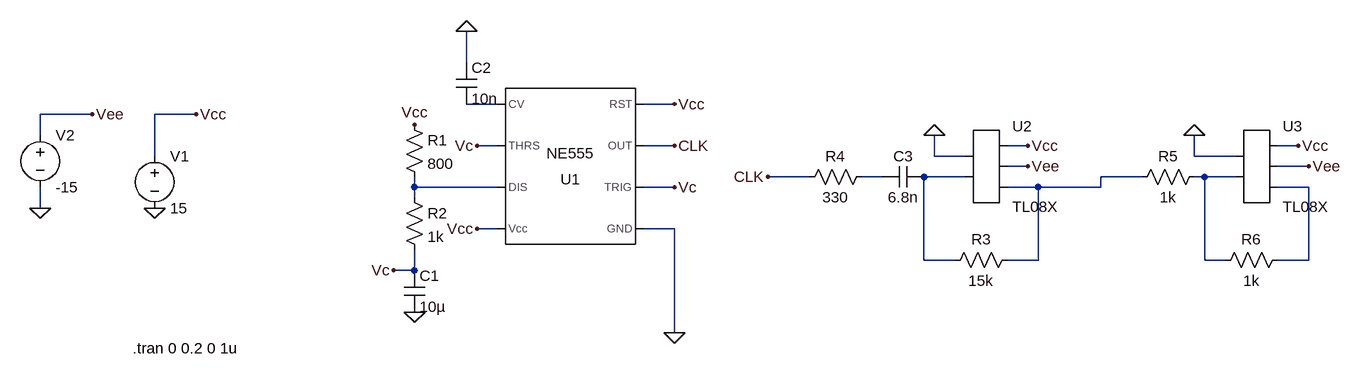
[diagram p0: schematic edge_detector_deriv.asc]
edge_detector_deriv.asc, the LTspice schematic file:
Version 4
SHEET 1 1340 680
WIRE -16 16 -16 -32
WIRE 32 80 -16 80
WIRE 304 80 256 80
WIRE -592 96 -672 96
WIRE -432 96 -496 96
WIRE -672 128 -672 96
WIRE 32 144 0 144
WIRE 304 144 256 144
WIRE 848 144 816 144
WIRE 1264 144 1232 144
WIRE -496 160 -496 96
WIRE 704 160 704 128
WIRE 752 160 704 160
WIRE 1104 160 1104 128
WIRE 1168 160 1104 160
WIRE 848 176 816 176
WIRE 1280 176 1232 176
WIRE 512 192 448 192
WIRE 624 192 592 192
WIRE 752 192 688 192
WIRE 1024 192 960 192
WIRE 1120 192 1104 192
WIRE 1168 192 1120 192
WIRE -96 208 -96 192
WIRE 32 208 -96 208
WIRE 304 208 256 208
WIRE 864 208 816 208
WIRE 960 208 960 192
WIRE 960 208 864 208
WIRE 1280 208 1232 208
WIRE -96 224 -96 208
WIRE -672 240 -672 208
WIRE 32 272 0 272
WIRE 304 272 256 272
WIRE 688 320 688 192
WIRE 736 320 688 320
WIRE 864 320 864 208
WIRE 864 320 816 320
WIRE 1120 320 1120 192
WIRE 1152 320 1120 320
WIRE 1280 320 1280 208
WIRE 1280 320 1232 320
WIRE -96 336 -96 304
WIRE -96 336 -128 336
WIRE 304 432 304 272
FLAG 304 432 0
FLAG -128 336 Vc
FLAG 0 144 Vc
FLAG -96 400 0
FLAG 0 272 Vcc
FLAG 304 80 Vcc
FLAG 304 208 Vc
FLAG -16 -32 0
FLAG -96 112 Vcc
FLAG -496 240 0
FLAG -432 96 Vcc
FLAG 304 144 CLK
FLAG 448 192 CLK
FLAG 848 144 Vcc
FLAG 704 128 0
FLAG 848 176 Vee
FLAG -672 240 0
FLAG -592 96 Vee
FLAG 1104 128 0
FLAG 1264 144 Vcc
FLAG 1280 176 Vee
SYMBOL Misc\\NE555 144 176 R180
SYMATTR InstName U1
SYMBOL res -112 96 R0
SYMATTR InstName R1
SYMATTR Value 800
SYMBOL res -112 208 R0
SYMATTR InstName R2
SYMATTR Value 1k
SYMBOL cap -112 336 R0
SYMATTR InstName C1
SYMATTR Value 10µ
SYMBOL cap -32 16 R0
SYMATTR InstName C2
SYMATTR Value 10n
SYMBOL voltage -496 144 R0
WINDOW 123 0 0 Left 0
WINDOW 39 0 0 Left 0
SYMATTR InstName V1
SYMATTR Value 15
SYMBOL cap 688 176 R90
WINDOW 0 0 32 VBottom 2
WINDOW 3 32 32 VTop 2
SYMATTR InstName C3
SYMATTR Value 6.8n
SYMBOL res 832 304 R90
WINDOW 0 0 56 VBottom 2
WINDOW 3 32 56 VTop 2
SYMATTR InstName R3
SYMATTR Value 15k
SYMBOL AutoGenerated\\TL08X 784 176 R0
SYMATTR InstName U2
SYMBOL res 608 176 R90
WINDOW 0 0 56 VBottom 2
WINDOW 3 32 56 VTop 2
SYMATTR InstName R4
SYMATTR Value 330
SYMBOL voltage -672 112 R0
WINDOW 123 0 0 Left 0
WINDOW 39 0 0 Left 0
SYMATTR InstName V2
SYMATTR Value -15
SYMBOL AutoGenerated\\TL08X 1200 176 R0
SYMATTR InstName U3
SYMBOL res 1120 176 R90
WINDOW 0 0 56 VBottom 2
WINDOW 3 32 56 VTop 2
SYMATTR InstName R5
SYMATTR Value 1k
SYMBOL res 1248 304 R90
WINDOW 0 0 56 VBottom 2
WINDOW 3 32 56 VTop 2
SYMATTR InstName R6
SYMATTR Value 1k
TEXT -530 456 Left 2 !.tran 0 0.2 0 1u

The netlist it stands for:
* edge_detector_deriv.asc
XU1 0 Vc CLK Vcc N001 Vc N006 Vcc NE555  ; pins GND TRIG OUT RST CV THRS DIS Vcc
R1 Vcc N006 800
R2 N006 Vc 1k
C1 Vc 0 10µ
C2 0 N001 10n
V1 Vcc 0 15
C3 N003 N002 6.8n
R3 N004 N003 15k
* U2: TL08X (symbol AutoGenerated\TL08X not available, pins judged from their places): pin1=0 pin2=N003 pin3=Vcc pin4=Vee pin5=N004
R4 N002 CLK 330
V2 Vee 0 -15
* U3: TL08X (symbol AutoGenerated\TL08X not available, pins judged from their places): pin1=0 pin2=N005 pin3=Vcc pin4=Vee pin5=N007
R5 N005 N004 1k
R6 N007 N005 1k
.tran 0 0.2 0 1u
.lib NE555.sub
.backanno
.end